# EAGLE board Daughter Card v7 fixed (EAGLE 8.4.1)
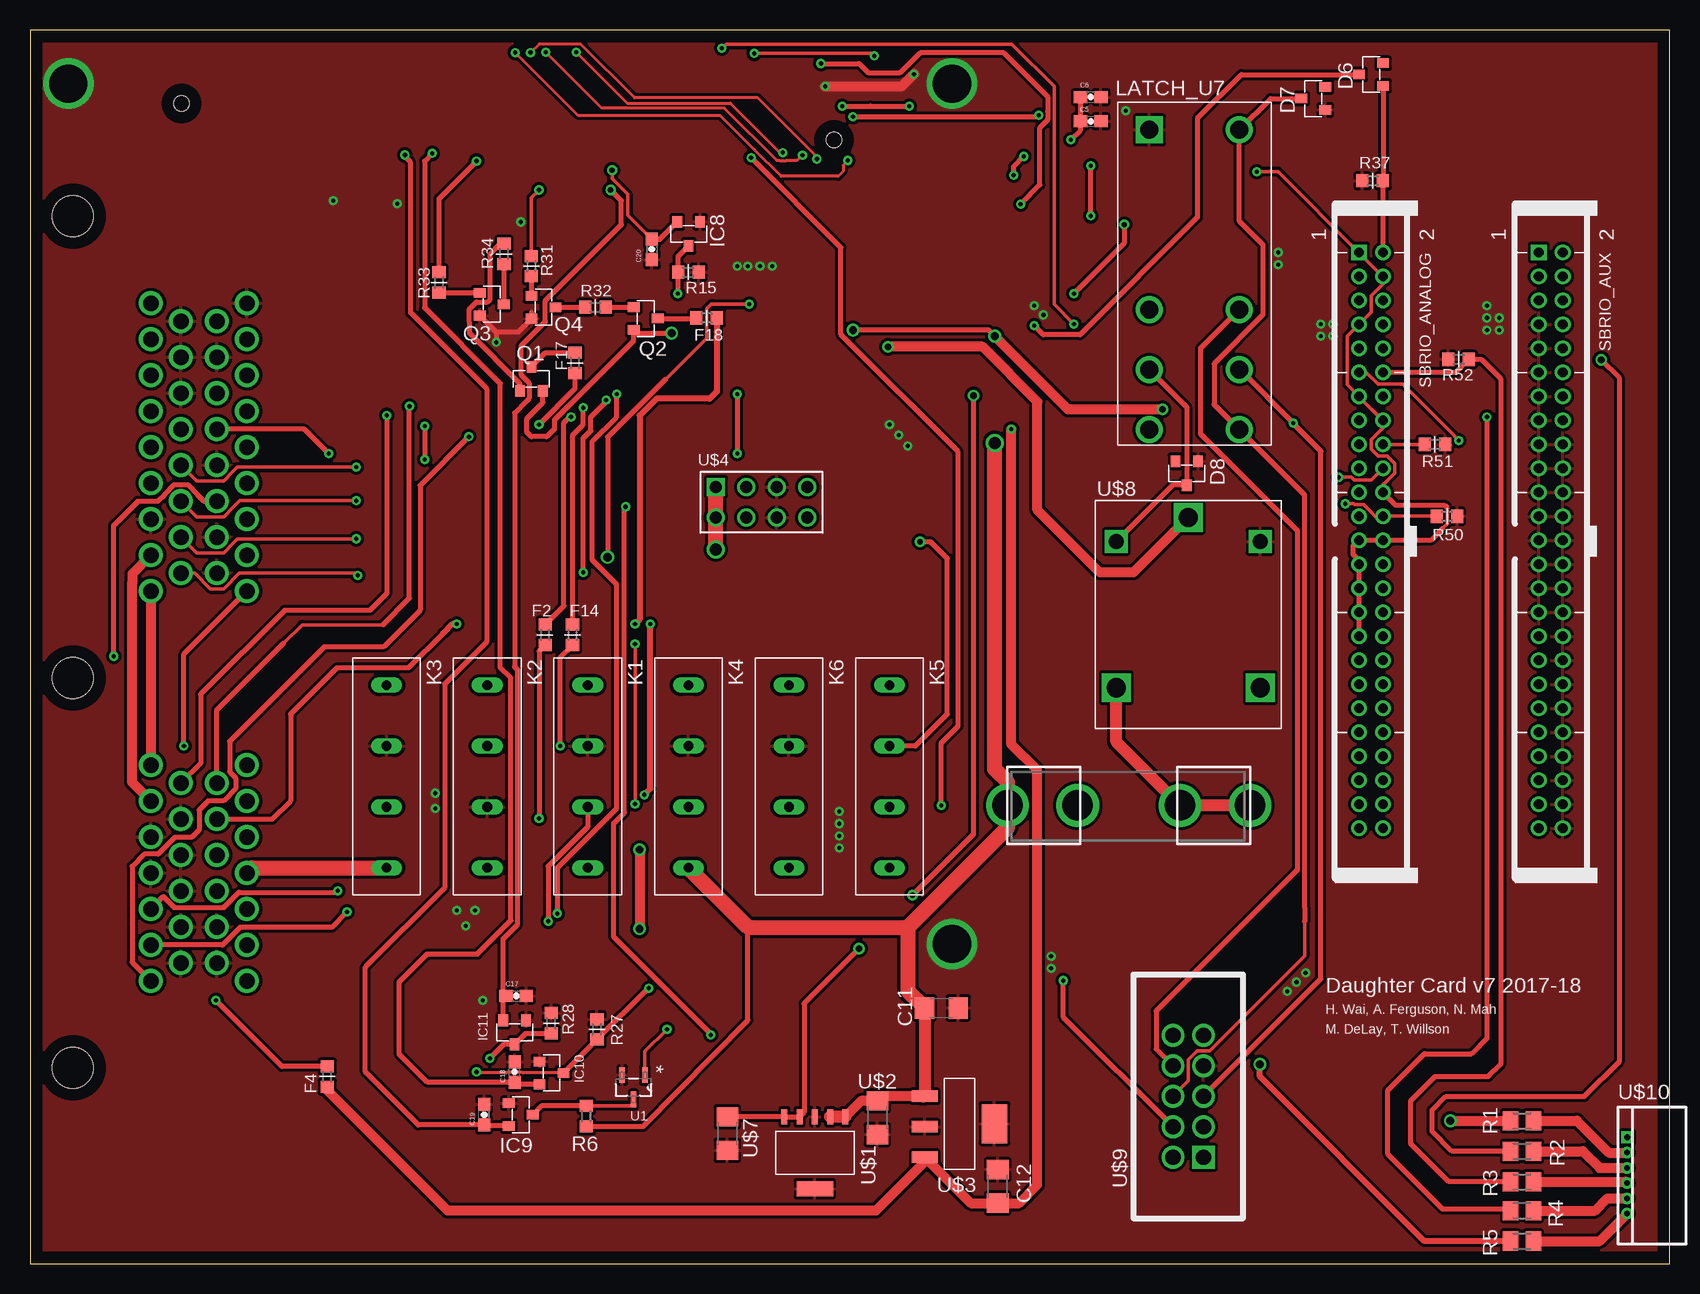
[diagram p2: board, top side]
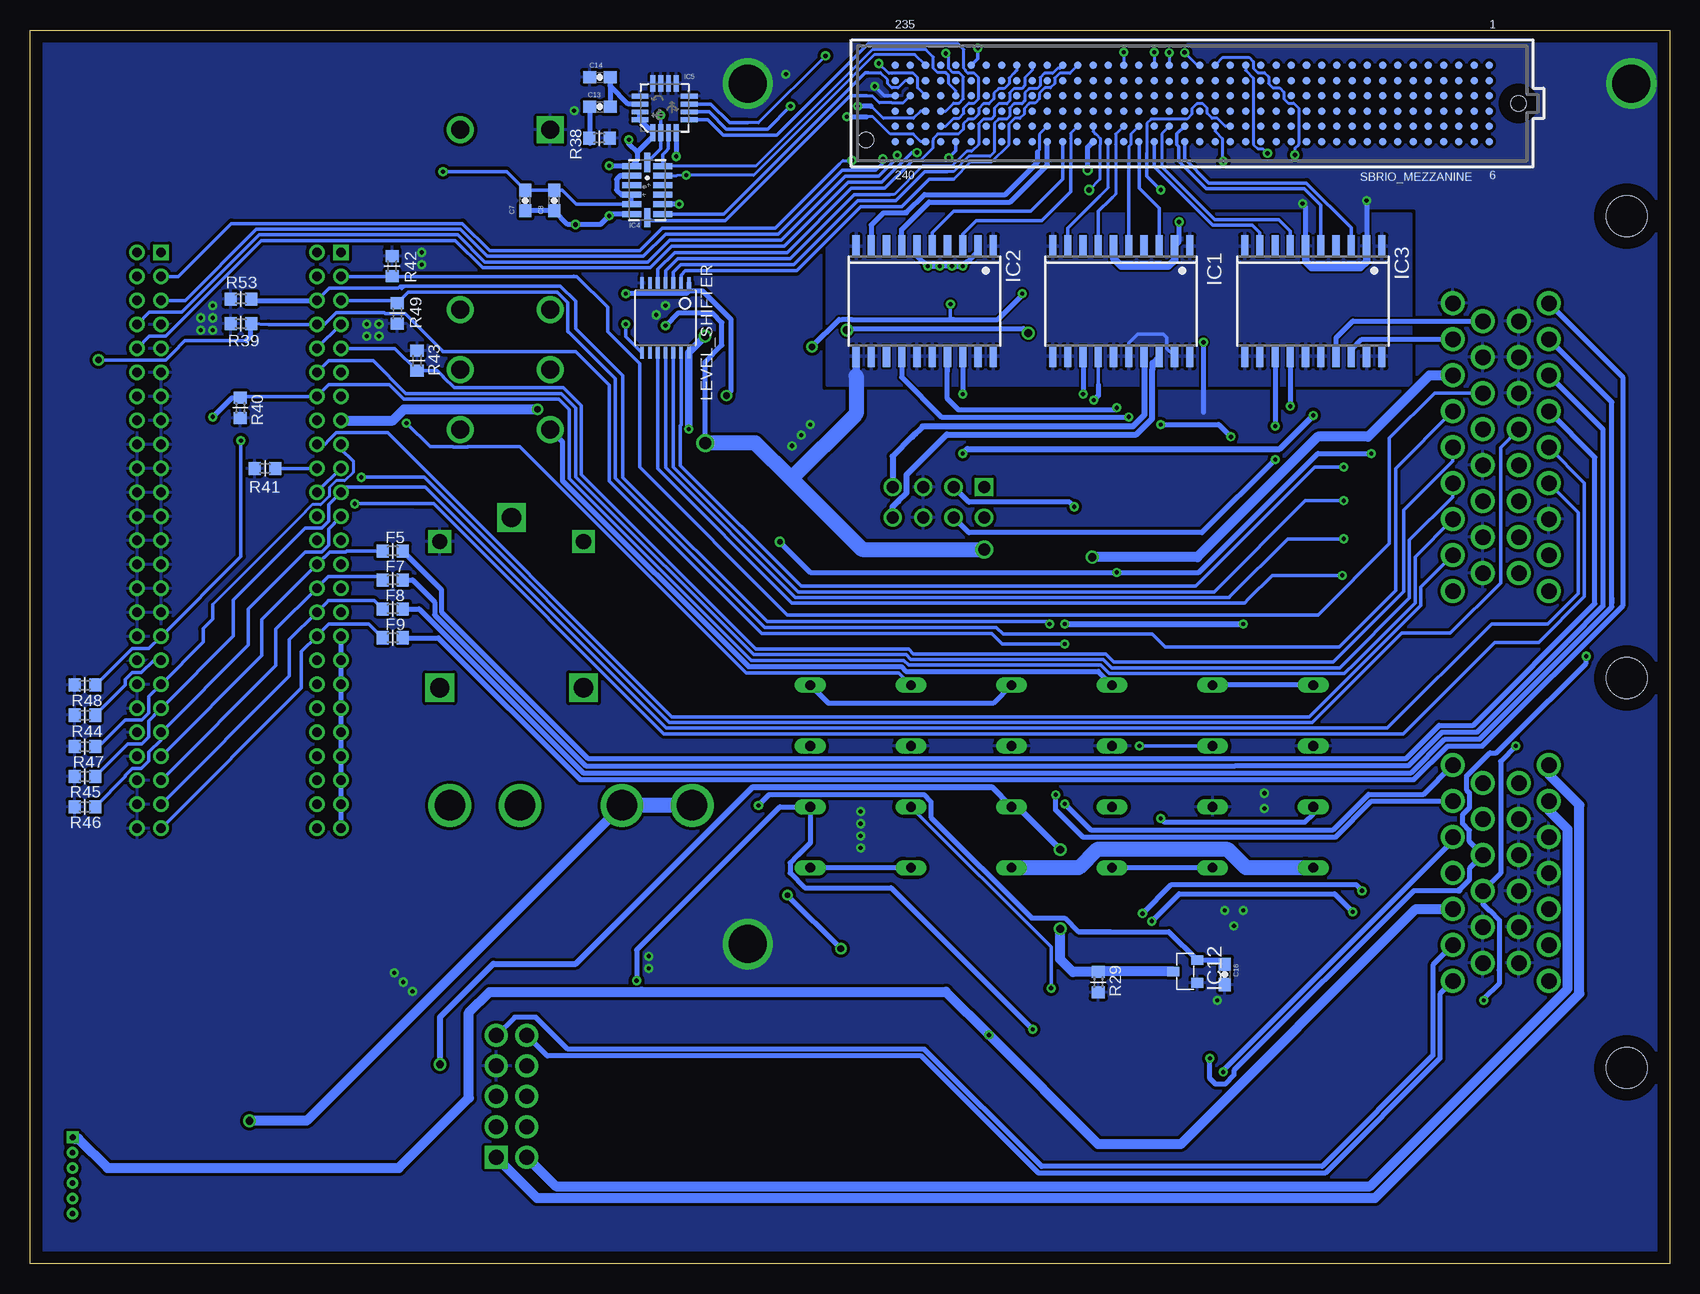
[diagram p3: board, bottom side, seen from below]

Size 136.65 x 102.87 mm. Coordinates in mm from the lower left corner, seen from the top.
Outline: 0,0 136.65,0 136.65,102.87 0,102.87 0,0
Copper layers (1*16): Top 0.035mm / dielectric 1.5mm / Bottom 0.035mm
Design rules "default *": minimum track width 10mil, minimum drill 12mil, track to track 6.5mil, track to pad 6.5mil, pad to pad 6.5mil, via to via 6.5mil, smd to smd 6.5mil, copper to edge 40mil, drill to drill 8mil, minimum pad ring 10mil, minimum via ring 8mil, stop-mask expansion 4mil, vias tented up to drill 0mil, thermal gap 10mil

## Footprints (pad centres in the part's own frame; a part is rotated, then mirrored left to right if it is on the bottom)
0603-CAP = smd 1.1 x 1: 1 -0.85,0; 2 0.85,0
C1206 = smd 1.6 x 1.8: 1 -1.4,0; 2 1.4,0
SOT-23-3 = smd 0.8 x 0.976: P$1 0,1; P$2 -0.95,-1; P$3 0.95,-1
R0603 = smd 1 x 1.1: 1 -0.85,0; 2 0.85,0
FUSE_5MM = drill 2.54 pad 3.556: 1 0,-10.1; 2 0,-4.258; 3 0,4.258; 4 0,10.1
PG-DSO-20 = smd 0.6 x 1.8: 1 -5.715,-4.6; 2 -4.445,-4.6; 3 -3.175,-4.6; 4 -1.905,-4.6; 5 -0.635,-4.6; 6 0.635,-4.6; 7 1.905,-4.6; 8 3.175,-4.6; 9 4.445,-4.6; 10 5.715,-4.6; 11 5.715,4.6; 12 4.445,4.6; 13 3.175,4.6; 14 1.905,4.6; 15 0.635,4.6; 16 -0.635,4.6; 17 -1.905,4.6; 18 -3.175,4.6; 19 -4.445,4.6; 20 -5.715,4.6
LGA14 = smd 0.5 x 1.6: 1 2,1.3; 2 1.2,1.3; 3 0.4,1.3; 4 -0.4,1.3; 5 -1.2,1.3; 6 -2,1.3; 8 -2,-1.3; 9 -1.2,-1.3; 10 -0.4,-1.3; 11 0.4,-1.3; 12 1.2,-1.3; 13 2,-1.3 | smd 1.6 x 0.5: 7 -2.3,0; 14 2.3,0
LGA16-4X4 = smd 1.4 x 0.4: 1 -2.05,0.975; 2 -2.05,0.325; 3 -2.05,-0.325; 4 -2.05,-0.975; 9 2.05,-0.975; 10 2.05,-0.325; 11 2.05,0.325; 12 2.05,0.975 | smd 0.4 x 1.4: 5 -0.975,-2.05; 6 -0.325,-2.05; 7 0.325,-2.05; 8 0.975,-2.05; 13 0.975,2.05; 14 0.325,2.05; 15 -0.325,2.05; 16 -0.975,2.05
HE3621A1250_SPST = drill 0.8 long: C+ -2.54,0; C- 2.54,0; S1 -7.62,0; S2 7.62,0
DPDT_JW2_FORM_C = drill 1.5: CENTER_1 -8,3.75; CENTER_2 -8,-3.75; COIL_2 12,-3.75; NC_1 -3,3.75; NC_2 -3,-3.75; NO_1 -13,3.75; NO_2 -13,-3.75 | drill 1.5 square: COIL_1 12,3.75
TSSOP14 = smd 0.305 x 0.991: 1 -1.95,-2.918; 2 -1.3,-2.918; 3 -0.65,-2.918; 4 0,-2.918; 5 0.65,-2.918; 6 1.3,-2.918; 7 1.95,-2.918; 8 1.95,2.918; 9 1.3,2.918; 10 0.65,2.918; 11 0,2.918; 12 -0.65,2.918; 13 -1.3,2.918; 14 -1.95,2.918
M0805 = smd 1.3 x 1.6: 1 -0.95,0; 2 0.95,0
SBRIO_J502_J503 = drill 0.8 square: P$1 0,0 | drill 0.8: P$2 0,2; P$3 2,0; P$4 2,2; P$5 4,0; P$6 4,2; P$7 6,0; P$8 6,2; P$9 8,0; P$10 8,2; P$11 10,0; P$12 10,2; P$13 12,0; P$14 12,2; P$15 14,0; P$16 14,2; P$17 16,0; P$18 16,2; P$19 18,0; P$20 18,2; P$21 20,0; P$22 20,2; P$23 22,0; P$24 22,2; P$25 24,0; P$26 24,2; P$27 26,0; P$28 26,2; P$29 28,0; P$30 28,2; P$31 30,0; P$32 30,2; P$33 32,0; P$34 32,2; P$35 34,0; P$36 34,2; P$37 36,0; P$38 36,2; P$39 38,0; P$40 38,2; P$41 40,0; P$42 40,2; P$43 42,0; P$44 42,2; P$45 44,0; P$46 44,2; P$47 46,0; P$48 46,2; P$49 48,0; P$50 48,2
SEAM-40-XX.X-XX-06-X-A = smd 0.635 x 0.635: 1 24.765,3.175; 2 24.765,1.905; 3 24.765,0.635; 4 24.765,-0.635; 5 24.765,-1.905; 6 24.765,-3.175; 7 23.495,3.175; 8 23.495,1.905; 9 23.495,0.635; 10 23.495,-0.635; 11 23.495,-1.905; 12 23.495,-3.175; 13 22.225,3.175; 14 22.225,1.905; 15 22.225,0.635; 16 22.225,-0.635; 17 22.225,-1.905; 18 22.225,-3.175; 19 20.955,3.175; 20 20.955,1.905; 21 20.955,0.635; 22 20.955,-0.635; 23 20.955,-1.905; 24 20.955,-3.175; 25 19.685,3.175; 26 19.685,1.905; 27 19.685,0.635; 28 19.685,-0.635; 29 19.685,-1.905; 30 19.685,-3.175; 31 18.415,3.175; 32 18.415,1.905; 33 18.415,0.635; 34 18.415,-0.635; 35 18.415,-1.905; 36 18.415,-3.175; 37 17.145,3.175; 38 17.145,1.905; 39 17.145,0.635; 40 17.145,-0.635; 41 17.145,-1.905; 42 17.145,-3.175; 43 15.875,3.175; 44 15.875,1.905; 45 15.875,0.635; 46 15.875,-0.635; 47 15.875,-1.905; 48 15.875,-3.175; 49 14.605,3.175; 50 14.605,1.905; 51 14.605,0.635; 52 14.605,-0.635; 53 14.605,-1.905; 54 14.605,-3.175; 55 13.335,3.175; 56 13.335,1.905; 57 13.335,0.635; 58 13.335,-0.635; 59 13.335,-1.905; 60 13.335,-3.175; 61 12.065,3.175; 62 12.065,1.905; 63 12.065,0.635; 64 12.065,-0.635; 65 12.065,-1.905; 66 12.065,-3.175; 67 10.795,3.175; 68 10.795,1.905; 69 10.795,0.635; 70 10.795,-0.635; 71 10.795,-1.905; 72 10.795,-3.175; 73 9.525,3.175; 74 9.525,1.905; 75 9.525,0.635; 76 9.525,-0.635; 77 9.525,-1.905; 78 9.525,-3.175; 79 8.255,3.175; 80 8.255,1.905; 81 8.255,0.635; 82 8.255,-0.635; 83 8.255,-1.905; 84 8.255,-3.175; 85 6.985,3.175; 86 6.985,1.905; 87 6.985,0.635; 88 6.985,-0.635; 89 6.985,-1.905; 90 6.985,-3.175; 91 5.715,3.175; 92 5.715,1.905; 93 5.715,0.635; 94 5.715,-0.635; 95 5.715,-1.905; 96 5.715,-3.175; 97 4.445,3.175; 98 4.445,1.905; 99 4.445,0.635; 100 4.445,-0.635; 101 4.445,-1.905; 102 4.445,-3.175; 103 3.175,3.175; 104 3.175,1.905; 105 3.175,0.635; 106 3.175,-0.635; 107 3.175,-1.905; 108 3.175,-3.175; 109 1.905,3.175; 110 1.905,1.905; 111 1.905,0.635; 112 1.905,-0.635; 113 1.905,-1.905; 114 1.905,-3.175; 115 0.635,3.175; 116 0.635,1.905; 117 0.635,0.635; 118 0.635,-0.635; 119 0.635,-1.905; 120 0.635,-3.175; 121 -0.635,3.175; 122 -0.635,1.905; 123 -0.635,0.635; 124 -0.635,-0.635; 125 -0.635,-1.905; 126 -0.635,-3.175; 127 -1.905,3.175; 128 -1.905,1.905; 129 -1.905,0.635; 130 -1.905,-0.635; 131 -1.905,-1.905; 132 -1.905,-3.175; 133 -3.175,3.175; 134 -3.175,1.905; 135 -3.175,0.635; 136 -3.175,-0.635; 137 -3.175,-1.905; 138 -3.175,-3.175; 139 -4.445,3.175; 140 -4.445,1.905; 141 -4.445,0.635; 142 -4.445,-0.635; 143 -4.445,-1.905; 144 -4.445,-3.175; 145 -5.715,3.175; 146 -5.715,1.905; 147 -5.715,0.635; 148 -5.715,-0.635; 149 -5.715,-1.905; 150 -5.715,-3.175; 151 -6.985,3.175; 152 -6.985,1.905; 153 -6.985,0.635; 154 -6.985,-0.635; 155 -6.985,-1.905; 156 -6.985,-3.175; 157 -8.255,3.175; 158 -8.255,1.905; 159 -8.255,0.635; 160 -8.255,-0.635; 161 -8.255,-1.905; 162 -8.255,-3.175; 163 -9.525,3.175; 164 -9.525,1.905; 165 -9.525,0.635; 166 -9.525,-0.635; 167 -9.525,-1.905; 168 -9.525,-3.175; 169 -10.795,3.175; 170 -10.795,1.905; 171 -10.795,0.635; 172 -10.795,-0.635; 173 -10.795,-1.905; 174 -10.795,-3.175; 175 -12.065,3.175; 176 -12.065,1.905; 177 -12.065,0.635; 178 -12.065,-0.635; 179 -12.065,-1.905; 180 -12.065,-3.175; 181 -13.335,3.175; 182 -13.335,1.905; 183 -13.335,0.635; 184 -13.335,-0.635; 185 -13.335,-1.905; 186 -13.335,-3.175; 187 -14.605,3.175; 188 -14.605,1.905; 189 -14.605,0.635; 190 -14.605,-0.635; 191 -14.605,-1.905; 192 -14.605,-3.175; 193 -15.875,3.175; 194 -15.875,1.905; 195 -15.875,0.635; 196 -15.875,-0.635; 197 -15.875,-1.905; 198 -15.875,-3.175; 199 -17.145,3.175; 200 -17.145,1.905; 201 -17.145,0.635; 202 -17.145,-0.635; 203 -17.145,-1.905; 204 -17.145,-3.175; 205 -18.415,3.175; 206 -18.415,1.905; 207 -18.415,0.635; 208 -18.415,-0.635; 209 -18.415,-1.905; 210 -18.415,-3.175; 211 -19.685,3.175; 212 -19.685,1.905; 213 -19.685,0.635; 214 -19.685,-0.635; 215 -19.685,-1.905; 216 -19.685,-3.175; 217 -20.955,3.175; 218 -20.955,1.905; 219 -20.955,0.635; 220 -20.955,-0.635; 221 -20.955,-1.905; 222 -20.955,-3.175; 223 -22.225,3.175; 224 -22.225,1.905; 225 -22.225,0.635; 226 -22.225,-0.635; 227 -22.225,-1.905; 228 -22.225,-3.175; 229 -23.495,3.175; 230 -23.495,1.905; 231 -23.495,0.635; 232 -23.495,-0.635; 233 -23.495,-1.905; 234 -23.495,-3.175; 235 -24.765,3.175; 236 -24.765,1.905; 237 -24.765,0.635; 238 -24.765,-0.635; 239 -24.765,-1.905; 240 -24.765,-3.175 | hole 1.27: 27.191,0; -27.191,-3.048
SOT95P235X112-3N = smd 1.321 x 0.457: 1 -1.016,0.94; 2 -1.016,-0.94; 3 1.016,0
TPS7A4533 = smd 0.508 x 1.27: P$1 -2.54,-2.997; P$2 -1.27,-2.997; P$3 0,-2.997; P$4 1.27,-2.997; P$5 2.54,-2.997 | smd 3.048 x 1.27: P$6 0,2.997
SOT-223-4 = smd 0.95 x 2.15: 1 -2.3,-2.9; 2 0.24,-2.9; 3 2.78,-2.9 | smd 3.25 x 2.15: 4 0,2.9
HARWIN_M20-9980445 = drill 1 square: P1 -3.81,1.27 | drill 1: P2 -1.27,1.27; P3 1.27,1.27; P4 3.81,1.27; P5 -3.81,-1.27; P6 -1.27,-1.27; P7 1.27,-1.27; P8 3.81,-1.27
SUPERSEAL1.0_60POS = drill 1.3 pad 2: A1 7.288,14.526; A2 10.288,14.526; A3 13.288,14.526; A4 16.288,14.526; A5 19.288,14.526; A6 22.288,14.526; A7 25.288,14.526; A8 28.288,14.526; A9 31.288,14.526; A10 8.788,12.026; A11 11.788,12.026; A12 14.788,12.026; A13 17.788,12.026; A14 20.788,12.026; A15 23.788,12.026; A16 26.788,12.026; A17 29.788,12.026; A18 8.788,9.026; A19 11.788,9.026; A20 14.788,9.026; A21 17.788,9.026; A22 20.788,9.026; A23 23.788,9.026; A24 26.788,9.026; A25 29.788,9.026; A26 7.288,6.526; A27 10.288,6.526; A28 13.288,6.526; A29 16.288,6.526; A30 19.288,6.526; A31 22.288,6.526; A32 25.288,6.526; A33 28.288,6.526; A34 31.288,6.526; B1 45.788,14.526; B2 48.788,14.526; B3 51.788,14.526; B4 54.788,14.526; B5 57.788,14.526; B6 60.788,14.526; B7 63.788,14.526; B8 47.288,12.026; B9 50.288,12.026; B10 53.288,12.026; B11 56.288,12.026; B12 59.288,12.026; B13 62.288,12.026; B14 47.288,9.026; B15 50.288,9.026; B16 53.288,9.026; B17 56.288,9.026; B18 59.288,9.026; B19 62.288,9.026; B20 45.788,6.526; B21 48.788,6.526; B22 51.788,6.526; B23 54.788,6.526; B24 57.788,6.526; B25 60.788,6.526; B26 63.788,6.526 | hole 3.4: 0.038,0.026; 38.538,0.026; 71.038,0.026
RELAY = drill 1.6 square: A 14.199,-5.994; B 14.199,5.994; CENTER 0,0 | drill 1.27 square: V1 2.007,5.994; V2 2.007,-5.994
SBRIO_W = drill 1.27 pad 1.778 square: P$1 -5.08,-1.27 | drill 1.27 pad 1.778: P$2 -5.08,1.27; P$3 -2.54,-1.27; P$4 -2.54,1.27; P$5 0,-1.27; P$6 0,1.27; P$7 2.54,-1.27; P$8 2.54,1.27; P$9 5.08,-1.27; P$10 5.08,1.27
SULLINS_1MM_HEADER = drill 0.5 pad 0.61 square: P1 0,0 | drill 0.45 pad 0.61: P2 1.27,0; P3 2.54,0; P4 3.81,0; P5 5.08,0; P6 6.35,0

## Placement (x,y rotation side)
C5  .1uF  [0603-CAP]  88.39,95.25 0 top
C6  10uF  [0603-CAP]  88.39,97.28 0 top
C7  .1uF  [0603-CAP]  95.38,88.65 90 bottom
C8  1uF  [0603-CAP]  92.96,88.65 90 bottom
C11  0.1uF  [C1206]  75.95,21.34 0 top
C12  0.22uF  [C1206]  80.64,6.48 90 top
C13  470nF  [0603-CAP]  89.15,96.47 0 bottom
C14  10nF  [0603-CAP]  89.15,98.93 0 bottom
C16  1uF  [0603-CAP]  37.08,24.13 270 bottom
C17  1uF  [0603-CAP]  40.51,22.35 0 top
C18  1uF  [0603-CAP]  40.39,16 90 top
C19  1uF  [0603-CAP]  37.85,12.45 90 top
C20  1uF  [0603-CAP]  51.82,84.58 270 top
D6  MMBZ5238B-7-F  [SOT-23-3]  111.76,99.16 90 top
D7  DIODE_MMBD4448  [SOT-23-3]  106.93,97.16 90 top
D8  DIODE_MMBD4448  [SOT-23-3]  96.39,65.91 180 top
F2  250mA  [R0603]  42.93,52.45 270 top
F3  FUSEX20MM  [FUSE_5MM]  91.57,38.23 90 top
F4  0.5A PTC  [R0603]  24.77,15.62 90 top
F5  10mA PTC  [R0603]  106.43,59.44 0 bottom
F7  10mA PTC  [R0603]  106.43,57.02 0 bottom
F8  10mA PTC  [R0603]  106.43,54.61 0 bottom
F9  10mA PTC  [R0603]  106.43,52.2 0 bottom
F14  250mA  [R0603]  45.21,52.45 270 top
F17  1A PTC  [R0603]  45.42,75.11 90 top
F18  1A PTC  [R0603]  56.39,78.87 180 top
IC1  BTS716G  [PG-DSO-20]  45.72,80.26 180 bottom
IC2  BTS716G  [PG-DSO-20]  62.1,80.26 180 bottom
IC3  BTS716G  [PG-DSO-20]  29.72,80.26 180 bottom
IC4  ADXL345  [LGA14]  85.22,89.53 90 bottom
IC5  L3G4200D  [LGA16-4X4]  83.77,96.37 90 bottom
IC8  MIC5225-3.3YM5-TR  [SOT-23-3]  54.89,85.88 180 top
IC9  MIC5225-3.3YM5-TR  [SOT-23-3]  40.89,12.45 270 top
IC10  MIC5225-3.3YM5-TR  [SOT-23-3]  43.46,15.93 270 top
IC11  MIC5225-3.3YM5-TR  [SOT-23-3]  40.39,19.3 180 top
IC12  MIC5225-3.3YM5-TR  [SOT-23-3]  40.39,24.38 90 bottom
K1  HE3621A1250_SPST  [HE3621A1250_SPST]  46.48,40.64 90 top
K2  HE3621A1250_SPST  [HE3621A1250_SPST]  38.1,40.64 270 top
K3  HE3621A1250_SPST  [HE3621A1250_SPST]  29.72,40.64 90 top
K4  HE3621A1250_SPST  [HE3621A1250_SPST]  54.86,40.64 90 top
K5  HE3621A1250_SPST  [HE3621A1250_SPST]  71.63,40.64 270 top
K6  HE3621A1250_SPST  [HE3621A1250_SPST]  63.25,40.64 90 top
LATCH_U7  JW2SN-DC12V  [DPDT_JW2_FORM_C]  97.03,82.55 90 top
LEVEL_SHIFTER  [TSSOP14]  83.69,78.87 180 bottom
Q1  MMBT4403-7-F  [SOT-23-3]  41.78,73.79 0 top
Q2  MMBT4403-7-F  [SOT-23-3]  51.31,78.82 270 top
Q3  MMBT4401-7-F  [SOT-23-3]  38.48,80.01 270 top
Q4  MMBT4401-7-F  [SOT-23-3]  42.8,79.76 270 top
R1  0  [M0805]  124.33,11.94 180 top
R2  0  [M0805]  124.33,9.4 180 top
R3  0  [M0805]  124.33,6.86 180 top
R4  0  [M0805]  124.33,4.45 180 top
R5  0  [M0805]  124.33,1.91 180 top
R6  100K  [R0603]  46.35,12.32 90 top
R15  10K  [R0603]  54.86,82.68 0 top
R27  10K  [R0603]  47.24,19.56 90 top
R28  10K  [R0603]  43.43,20.07 90 top
R29  10K  [R0603]  47.62,23.5 270 bottom
R31  4.7K  [R0603]  41.78,83.19 270 top
R32  4.7K  [R0603]  47.12,79.76 0 top
R33  4.7K  [R0603]  34.09,81.81 270 top
R34  4.7K  [R0603]  39.5,84.2 90 top
R37  10K  [R0603]  111.89,90.3 0 top
R38  10K  [R0603]  89.2,93.85 0 bottom
R39  100k  [R0603]  119.08,78.38 180 bottom
R40  100k  [R0603]  119.13,71.37 270 bottom
R41  100k  [R0603]  117.07,66.32 180 bottom
R42  100k  [R0603]  106.48,83.19 90 bottom
R43  100k  [R0603]  104.39,75.31 90 bottom
R44  100k  [R0603]  132.08,45.75 180 bottom
R45  100k  [R0603]  132.08,40.64 180 bottom
R46  100k  [R0603]  132.08,38.1 0 bottom
R47  100k  [R0603]  132.08,43.13 0 bottom
R48  100k  [R0603]  132.08,48.26 0 bottom
R49  100k  [R0603]  106.05,79.25 90 bottom
R50  100k  [R0603]  118.08,62.33 180 top
R51  100k  [R0603]  117.07,68.33 180 top
R52  100k  [R0603]  119.05,75.41 0 top
R53  100k  [R0603]  119.08,80.44 0 bottom
SBRIO_ANALOG  SBRIO_MIO  [SBRIO_J502_J503]  110.74,84.33 270 top
SBRIO_AUX  SBRIO_AUX  [SBRIO_J502_J503]  125.73,84.33 270 top
SBRIO_MEZZANINE  SBRIO_RMC  [SEAM-40-XX.X-XX-06-X-A]  39.8,96.75 0 bottom
U1  DMN3404L-7  [SOT95P235X112-3N]  50.29,14.73 270 top
U$1  TPS7A4533  [TPS7A4533]  65.41,9.27 180 top
U$2  10uF  [C1206]  70.61,12.19 270 top
U$3  LM340MP-5.0  [SOT-223-4]  77.47,11.68 270 top
U$4  HARWIN_M20-9980445  [HARWIN_M20-9980445]  60.96,63.5 0 top
U$6  SUPERSEAL1.0_60POS  [SUPERSEAL1.0_60POS]  3.56,87.38 270 top
U$7  10uF  [C1206]  58.12,10.87 270 top
U$8  RELAY  [RELAY]  96.52,62.23 270 top
U$9  SBRIO_BMS_CONN  [SBRIO_W]  96.52,13.97 90 top
U$10  SULLINS_1MM_6P_HEADER  [SULLINS_1MM_HEADER]  133.1,10.54 270 top

## Tracks (layer width: path | path; a pad name or v marks a point on that pad's centre or on a via)
3.3V  (via drill 0.35, 0.4, 0.45, 0.55)
  Top 0.406: v91.19,86.65 91.19,85.09 v87,80.9 | U$7.1 U$1.P$5 U$1.P$4 64.52,12.65 64.52,21.72 v69.09,26.29 | v78.61,72.39 78.61,35.81 v73.53,30.73 | v88.39,87.38 v88.39,91.57 | v86.74,93.73 87.54,94.53 C5.1 C6.1
  Top 0.813: U$7.1
  Bottom 0.305: LEVEL_SHIFTER.1 | 84.74,93.98 IC5.1 | 86.61,87.44 IC4.6
  Bottom 0.406: 86.96,80.93 v87,80.9 81.95,80.9 81.74,81.11 | C7.1 C8.1 91.82,86.65 v91.19,86.65 89.11,86.65 v88.39,87.38 88.23,87.53 IC4.6 | 84.74,93.98 86.06,92.66 | IC5.1 IC5.16 IC5.15 | 86.06,92.66 86.06,91.99 IC4.1 86.55,91.57 v88.39,91.57 | v73.53,30.73 v69.09,26.29 | 86.06,92.66 86.74,93.34 v86.74,93.73 | v78.61,72.39 78.23,72.77 78.23,78.74 80.6,81.11 81.74,81.11 | LEVEL_SHIFTER.1 81.74,81.11
5V  (via drill 0.35, 0.55, 0.65)
  Top 0.254: 30.22,9.02 30.35,8.89
  Top 0.406: v80.39,77.34 79.88,77.85 v68.58,77.85 | Q1.P$3 42.73,71.82 41.4,70.48 41.4,69.34 41.78,68.96 43.05,68.96 43.69,69.6 43.69,70.36 50.31,76.98 Q2.P$3 50.58,77.6 v53.47,77.6
  Top 0.508: 25.97,13.27 30.35,8.89
  Top 0.813: 74.56,8.89 U$3.3 | v81.76,69.6 81.79,69.57 81.79,43.31 83.93,41.16 83.93,6.59 82.42,5.08 C12.1 78.4,5.08 U$3.3 | F4.1 24.77,14.48 25.97,13.27 34.8,4.45 70.48,4.45 74.57,8.53 U$3.3 | v94.36,71.25 86.49,71.25 v80.39,77.34
  Bottom 0.305: 81.76,75.93 LEVEL_SHIFTER.14
  Bottom 0.406: 81.68,76.01 LEVEL_SHIFTER.14 | v68.58,77.85 68.45,77.98 53.85,77.98 v53.47,77.6
  Bottom 0.61: v81.76,69.6 81.76,75.93 | LEVEL_SHIFTER.14 81.74,75.99 v80.39,77.34
  Bottom 0.813: v80.39,77.34 80.39,77.3 | SBRIO_ANALOG.P$15 106.4,70.33 105.48,71.25 v94.36,71.25
5V_FUSED  (via drill 0.35)
  Top 0.406: v12.83,43.18 12.83,50.83 U$6.A9 | F4.2 20.99,16.47 v15.49,21.97
  Bottom 0.406: v12.83,43.18 14.1,41.91 14.1,32.57 U$6.B11 15.58,30 15.03,29.46 15.02,29.46 14.21,28.66 14.21,24.52 14.23,24.51 14.23,23.37 15.49,22.1 v15.49,21.97
5V_IO_1  (via drill 0.35)
  Top 0.406: F17.1 45.41,72.97 v42.42,69.98 | v36.58,68.96 32.51,64.9 32.51,54.48 29.46,51.44 24.51,51.44 16.64,43.56 16.64,41.02 17.14,40.51 17.14,39.62 16.13,38.61 14.86,38.61 14.1,37.85 14.1,36.2 13.46,35.56 12.06,35.56 10.67,34.16 9.53,34.16 8.51,33.15 8.51,25.16 U$6.B26
  Bottom 0.406: v42.42,69.98 37.59,69.98 v36.58,68.96
12V  (via drill 0.35, 0.65, 1)
  Top 0.406: R6.1 51.09,11.47 59.82,20.32 59.82,28.07 | D6.P$1 100.94,99.16 97.28,95.5 97.28,87.25 87.5,77.47 84.45,77.47 v83.69,78.23
  Top 0.813: v118.36,11.94 R1.2 | U$3.1 71,13.98 U$2.1 69.27,13.59 U$1.P$1
  Top 1.016: C11.1 74.57,21.31 U$3.1 74.31,13.98 | U$1.P$1 U$1.P$2
  Top 1.27: C11.1 73.15,22.73 73.15,28.07 | K3.S1 18.51,33.02 U$6.B4 | 73.15,28.07 81.47,36.38 F3.4 81.47,40.17 80.39,41.24 v80.39,68.45 | K4.S1 59.82,28.07 73.15,28.07 | U$4.P1 U$4.P5 v57.15,59.56
  Bottom 0.305: IC1.19 41.91,76.3 41.91,77.22 42.22,77.52 44.32,77.52 45.09,76.76 IC1.16
  Bottom 0.406: v80.39,68.45 80.39,75.18 78.99,76.58 78.99,78.49 79.76,79.25 82.68,79.25 v83.69,78.23
  Bottom 0.61: 67.82,74.04 IC2.11 67.85,75.69
  Bottom 0.813: F3.3 113.6,11.94 v118.36,11.94
  Bottom 1.27: F3.4 F3.3 | K3.S1 35.31,33.02 36.83,34.54 47.75,34.54 49.28,33.02 K4.S1 | v80.39,68.45 76.2,68.45 73.22,65.47 | 73.22,65.47 67.31,59.56 v57.15,59.56 | 73.22,65.47 67.82,70.87 67.82,74.04
  pour Bottom (isolate 0.152): 21.59,87.5 70.23,87.5 70.23,73.28 21.59,73.28
ACCUMULATOR_FANS
  Bottom 0.508: U$4.P8 64.77,63.13 64.3,63.6 64.28,63.6 63.6,64.28 63.6,65.79 60.25,69.14 44.46,69.14 43.14,70.46 43.14,74.54 43.1,74.59 43.1,75.11 IC1.18
AI7  (via drill 0.35)
  Top 0.305: R50.2 SBRIO_ANALOG.P$24 112.1,62.33 111.72,62.71 111.72,62.73 111.15,63.3 110.4,63.3 110.33,63.37 v109.6,63.37
  Bottom 0.305: U$6.A30 7.11,65.12 7.11,55.63 10.92,51.82 14.61,51.82 22.23,44.2 83.82,44.2 103,63.37 104.52,63.37 | 104.52,63.37 v109.6,63.37 | 104.52,63.37 103.25,63.37
AI8
  Bottom 0.305: 106.61,82.33 SBRIO_ANALOG.P$3 | 106.61,82.33 R42.1 | 91.31,82.33 91.09,82.33 88.52,79.76 88.52,77.72 85.85,75.06 85.85,66.42 73.54,54.11 29.31,54.11 23.37,60.05 23.37,68.83 19.61,72.59 U$6.A12 | 91.31,82.33 91.32,82.33 | 91.31,82.33 106.61,82.33
AI9
  Bottom 0.305: SBRIO_ANALOG.P$5 106.28,80.33 R49.2 105.12,81.03 92.73,81.03 92.7,80.99 92.68,80.99 91.83,80.15 91.83,77.74 91.57,77.47 | 91.57,77.47 91.85,77.75 | 91.57,77.47 87.88,73.79 87.88,65.53 75.42,53.07 56.12,53.07 55.56,52.51 43.12,52.51 42.04,51.44 27.56,51.44 22.86,56.13 22.86,63.58 | 22.86,63.58 | 22.86,63.58 22.86,66.31 U$6.A4
AI10
  Bottom 0.305: SBRIO_ANALOG.P$9 106.26,76.33 R43.1 102.71,74.46 102.22,73.97 102.22,73.95 101.31,73.04 92.2,73.04 90.72,71.56 | 90.72,71.56 | 90.72,71.56 90.72,65.81 76.17,51.26 63.44,51.26 63.05,50.86 47.02,50.86 46.33,50.17 28.06,50.17 22.16,56.07 22.16,62.87 18.08,66.95 U$6.A5
AI11  (via drill 0.35)
  Top 0.305: SBRIO_ANALOG.P$11 111.37,74.33 112.34,73.36 114.39,73.36 118.74,69.01 118.74,68.99 v119.07,68.65
  Bottom 0.305: v119.07,68.65 119.07,58.99 SBRIO_AUX.P$33 126.77,51.29 127.31,51.29 127.33,51.3 128.13,51.3 131.17,48.26 R48.2 131.15,48.26
AI12
  Bottom 0.305: R44.1 128.7,48.27 128.7,48.73 128.13,49.3 127.39,49.3 126.36,50.33 SBRIO_AUX.P$35
AI13
  Bottom 0.254: 121.41,54.99 113.7,62.69 113.7,62.73 113.14,63.29 112.43,63.29 111.7,64.01 111.7,64.72 111.14,65.29 110.43,65.29 109.73,65.99 109.73,66.93
  Bottom 0.305: 130.93,43.13 R47.2 130.93,43.13 | SBRIO_ANALOG.P$17 110.74,67.94 109.73,66.93 | 121.41,54.99 121.41,53.78 122.22,52.96 122.22,51.83 SBRIO_AUX.P$37 126.76,47.3 126.76,45.93 127.33,45.36 128.7,45.36 130.93,43.13
AI15
  Bottom 0.305: SBRIO_ANALOG.P$23 111.3,61.77 111.3,61.73 111.77,61.26 111.77,59.93 112.34,59.36 113.72,59.36 118.45,54.62 118.45,51.6 SBRIO_AUX.P$41 125.73,43.7 126.76,42.67 126.76,41.93 127.39,41.3 128.13,41.3 128.7,40.73 128.7,40.63 R46.2
AMS_OK-  (via drill 0.35)
  Top 0.305: v53.09,19.56 51.23,17.7 U1.1
  Top 0.406: U$9.P$4 86.11,20.57 v86.11,23.62
  Bottom 0.406: v86.11,23.62 86.11,26.16 74.17,38.1 K5.C- 71.63,35.1 72.69,34.04 72.7,34.04 73.3,33.44 73.3,32.6 72.08,31.37 64.9,31.37 v53.09,19.56
AO0
  Bottom 0.305: SBRIO_AUX.P$43 117.35,50.71 117.35,53.72 SBRIO_ANALOG.P$28 112.19,58.89 112.15,58.89 111.68,59.36 110.34,59.36 110.26,59.44 F5.1 107.42,59.29
AO1
  Bottom 0.305: SBRIO_AUX.P$45 116.16,49.9 116.16,52.91 SBRIO_ANALOG.P$30 111.78,57.29 111.16,57.29 111.15,57.3 107.55,57.3 107.54,57.29 | 107.54,57.29 F7.1 107.54,57.29
AO2
  Bottom 0.305: SBRIO_AUX.P$47 115.03,49.03 115.03,52.04 SBRIO_ANALOG.P$32 111.92,55.15 | 111.92,55.15 111.78,55.29 | F8.1 107.95,55.29 110.33,55.29 110.34,55.3 111.77,55.3 111.78,55.29 | 111.78,55.29 111.92,55.15
AO3
  Bottom 0.305: SBRIO_AUX.P$49 114.03,48.03 114.03,51.04 SBRIO_ANALOG.P$34 112.74,52.36 111.76,53.34 108.42,53.34 F9.1
BMS_CAN_H
  Bottom 0.406: U$6.B7 19.17,22.5 19.17,20.32 19.17,17.14 28.73,7.57 42.8,7.57 52.59,7.57 62.37,17.34 93.54,17.34 U$9.P$10
BMS_CAN_L
  Bottom 0.406: U$9.P$9 96.27,20.57 94.49,20.57 91.83,17.91 62.13,17.91 52.36,8.14 28.97,8.14 19.74,17.38 19.74,24.93 U$6.B6
BRAKE_PRESS_IN_1
  Top 0.406: R3.2 118.24,6.86 115.06,10.03 115.06,13.59 117.09,15.62 121.54,15.62 122.56,16.64 122.56,73.79 120.93,75.41 R52.2 118.81,74.33 SBRIO_ANALOG.P$12
  Bottom 0.305: SBRIO_ANALOG.P$12 111.77,75.3 110.34,75.3 110.33,75.29 108.04,75.29 105.32,72.57 92.39,72.57 91.19,71.36 91.19,65.61 76.36,50.79 63.64,50.79 63.24,50.39 47.22,50.39 46.52,49.7 27.52,49.7 21.7,55.52 21.7,60.34 18.08,63.95 U$6.A6
BRAKE_PRESS_IN_2  (via drill 0.35)
  Top 0.406: 123.26,4.57 117.73,4.57 113.16,9.14 113.16,14.48 116.2,17.53 120.14,17.53 121.41,18.8 v121.41,70.61
  Top 0.813: R4.2 123.26,4.57
  Bottom 0.305: R40.1 119.02,72.33 SBRIO_ANALOG.P$14 111.77,73.3 110.34,73.3 110.33,73.29 106.71,73.29 105.52,72.1 92.59,72.1 91.72,71.23 91.72,65.48 76.55,50.32 63.83,50.32 63.44,49.92 47.41,49.92 46.72,49.23 27.11,49.23 26.23,50.11 26.23,50.09 | U$6.A7 21.23,58.94 21.23,55.1 26.23,50.09 | 26.54,49.78 26.23,50.09
  Bottom 0.406: v121.41,70.61 119.8,72.22 R40.1
BRAKELIGHT
  Bottom 0.406: IC3.17 27.81,77.22 26.42,78.61 15.61,78.61 U$6.A10
BSPD_OK+  (via drill 0.65)
  Top 0.508: R5.2 116.2,1.91 102.49,15.62 v102.49,16.64
  Top 0.813: v50.8,34.54 v50.8,27.94
  Bottom 0.508: v102.49,16.64 102.49,20.57 98.04,25.02 91.15,25.02 76.42,39.75 56.52,39.75 K4.C+ 54.36,38.1 v50.8,34.54
  Bottom 0.813: v50.8,27.94 50.8,25.4 49.74,24.34 R29.1 47.59,24.38 IC12.P$1
BUZZER_OUT
  Bottom 0.406: IC3.18 26.54,76.2 25.65,77.09 U$6.A2
CAN_H
  Top 0.813: U$6.A33 8.52,57.53 8.52,56.77 8.5,56.74 8.5,40.17 U$6.B21
  Bottom 0.813: U$9.P$2 92.84,6.48 24.97,6.48 8.51,22.94 8.51,36.24 10.08,37.81 U$6.B21
CAN_L
  Top 0.813: U$6.A34 U$6.B20
  Bottom 0.813: U$9.P$1 94.41,5.51 93.25,5.51 93.24,5.5 24.57,5.5 7.53,22.53 7.53,38.26 10.08,40.81 U$6.B20
COOLANT_PUMP
  Bottom 0.508: U$4.P4 64.77,67.31 63.12,68.96 | 63.12,68.96 62.87,69.22 | IC1.17 43.81,70.74 43.83,70.74 44.76,69.81 62.27,69.81 63.12,68.96
DC_DC_DISABLE  (via drill 0.35)
  Top 0.406: U$6.B9 20.2,37.09 21.72,38.61 21.72,45.85 25.59,49.72 31.56,49.72 34.42,52.58
  Top 0.508: F18.1 57.24,72.73 56.64,72.14 52.22,72.14 50.81,70.73 50.81,53.73 v50.42,53.34 | v35.56,53.34 35.18,53.34 34.42,52.58
  Bottom 0.508: v50.42,53.34 v35.56,53.34
DIO0  (via drill 0.35)
  Top 0.406: v68.58,95.63 83.95,95.63 v84.07,95.76
  Bottom 0.254: 66.93,95.63 66.41,95.63 64.96,94.18 63.04,94.18 62.44,93.57 SBRIO_MEZZANINE.228
  Bottom 0.305: IC4.14 84.09,92.96 IC5.2 84.09,95.74 v84.07,95.76
  Bottom 0.406: v68.58,95.63 66.93,95.63
DIO1  (via drill 0.35)
  Top 0.406: v60.09,92.22 67.57,84.75 67.57,77.48 77.34,67.71 77.34,44.83 75.95,43.43 v75.95,38.23
  Bottom 0.305: SBRIO_MEZZANINE.216 59.49,92.83 v60.09,92.22
  Bottom 0.406: 46.61,27.69 49.3,27.69 | 46.61,27.69 41.74,27.69 IC12.P$3 37.44,25.33 C16.1 | v75.95,38.23 75.05,39.12 62.19,39.12 62.17,39.12 61.57,38.52 61.57,37.23 53.17,28.84 50.43,28.84 | 50.42,28.83 50.43,28.84 | 50.43,28.82 50.43,28.83 50.43,28.84 | 50.43,28.84 49.28,27.69 46.61,27.69
DIO5
  Bottom 0.406: IC2.7 64.01,86.23 61.72,88.52 54.97,88.52 51.87,91.62 SBRIO_MEZZANINE.180
DIO6
  Bottom 0.305: IC2.5 61.47,85.98 59.69,87.76 53.26,87.76 50.6,90.42 SBRIO_MEZZANINE.174
DIO7  (via drill 0.45)
  Top 0.305: C20.1 49.8,87.45 49.8,89.18 48.51,90.46 v48.51,91.19
  Top 0.406: C20.1 52.49,85.43 IC8.P$3
  Bottom 0.406: v48.51,91.19 48.51,93.12 SBRIO_MEZZANINE.162
DIO8
  Bottom 0.254: 47.5,89.03 46.79,89.74 SBRIO_MEZZANINE.156
  Bottom 0.305: 47.5,89.03 50.16,86.36 IC1.9
DIO9
  Bottom 0.254: 44.2,93.52 44.23,93.56 SBRIO_MEZZANINE.144
  Bottom 0.305: IC1.3 42.55,88.01 44.23,89.7 44.23,93.56
DIO10
  Bottom 0.305: IC3.9 34.16,85.98 34.78,86.6 38.1,86.6 42.98,91.47 42.98,91.69 | 42.98,93.38 SBRIO_MEZZANINE.138 42.98,91.69 | 42.98,91.69 42.98,91.49
DIO11
  Bottom 0.305: IC3.3 26.54,86.37 30.29,90.12 38.42,90.12 40.44,92.14 SBRIO_MEZZANINE.126
DIO16
  Bottom 0.254: 67.35,97.39 66.93,97.39 66.48,97.39 65.88,96.79 64.83,96.79 64.82,96.77 63.91,96.77 SBRIO_MEZZANINE.231
  Bottom 0.305: IC4.7 85.12,87.23 84.85,86.97 82.98,86.97 82.97,86.98 78.72,86.98 68.31,97.39 66.93,97.39
DIO17  (via drill 0.35)
  Top 0.406: v82.55,88.34 84.16,89.95 84.16,94.73 84.81,95.38 84.81,95.44 84.82,95.45 84.82,96.07 84.81,96.08 84.81,97.31 81.15,100.97 74.17,100.97 72.52,99.31 69.85,99.31 69.09,100.08 v65.91,100.08
  Bottom 0.254: v65.91,100.08 65.09,99.25 64.83,99.25 64.82,99.26 63.04,99.26 62.69,98.91 62.69,98.04 SBRIO_MEZZANINE.225
  Bottom 0.406: v82.55,88.34 IC4.9
DIO18
  Bottom 0.254: SBRIO_MEZZANINE.213 59.49,97.79 60.1,98.4 60.1,99.08 60.33,99.31 61.01,99.31 61.37,99.67 61.37,100.61 61.99,101.23 65.79,101.23 65.93,101.23 66.46,101.23 76.16,91.53 IC4.13
  Bottom 0.305: IC5.3 83.44,92.96 83.62,92.78 83.62,92.76 83.92,92.47 IC4.13
DIO32
  Bottom 0.254: 66.83,101.7 66.8,101.73 59.31,101.73 58.83,101.24 58.83,99.67 58.67,99.52 58.67,99.44 58.5,99.26 57.96,99.26 57.61,98.91 57.61,97.13 57.96,96.77 58.42,96.77 58.83,96.37 58.83,95.91 59.23,95.5 59.69,95.5 60.35,94.84 SBRIO_MEZZANINE.221
  Bottom 0.305: IC5.5 80.15,95.39 78.87,94.11 74.42,94.11 66.83,101.7
DIO37
  Bottom 0.254: SBRIO_MEZZANINE.179 52.54,94.17 52.54,93.84 52.53,93.83 52.53,92.89 52.7,92.71
  Bottom 0.305: 52.7,91.82 52.7,92
  Bottom 0.406: IC2.9 66.55,86.61 65.55,87.62 63.79,87.62 63.78,87.63 63.63,87.63 62.1,89.15 55.37,89.15 52.7,91.82 | 52.7,92.71 52.7,92
DIO38
  Bottom 0.254: SBRIO_MEZZANINE.167 49.92,94.25 49.92,93.84 49.94,93.83 49.94,92.02 49.91,92
  Bottom 0.305: IC2.3 58.93,85.85 57.78,87 52.32,87 49.91,89.41 49.91,92
DIO39  (via drill 0.45)
  Top 0.406: 39.44,20.39 IC11.P$3 39.44,22.58 | v48.39,89.53 49.28,88.65 49.28,86.64 42.94,80.31 42.94,78.54 42.44,78.04 42.42,78.04 40.95,76.56 40.95,74.08 41.6,73.43 41.6,72.15 41.39,71.93 41.37,71.93 40.39,70.95 40.39,49.78 40.64,49.53 40.64,28.32 39.44,27.12 39.44,22.58 | 39.44,22.58 C17.1
  Bottom 0.254: SBRIO_MEZZANINE.161 48.06,94.42 47.82,94.18 47.8,94.18 47.45,93.83 47.45,93.32 47.5,93.27 47.5,90.42 v48.39,89.53
DIO40
  Bottom 0.254: 46.61,88.77 46.19,89.19 46.19,93.31 46.18,93.32 46.18,94.18 SBRIO_MEZZANINE.149
  Bottom 0.305: IC1.7 47.62,87.76 46.61,88.77 46.48,88.9
DIO41
  Bottom 0.254: 45.09,91.19 45.09,93.14 44.91,93.32 44.91,94.18 SBRIO_MEZZANINE.143
  Bottom 0.305: 45.09,91.95 45.09,91.19 IC1.5
DIO42
  Bottom 0.254: SBRIO_MEZZANINE.131 42.33,94.22 42.33,91.49
  Bottom 0.305: 42.33,91.49 37.91,87.07 33.66,87.07 33.47,87.07 32.59,87.07 31.62,86.11 IC3.7
DIO43
  Bottom 0.305: IC3.5 29.08,88.25 30.48,89.65 38.61,89.65 40.91,91.94 40.91,93.14 41.07,93.31 41.07,94.21 SBRIO_MEZZANINE.125
DIO44  (via drill 0.35)
  Top 0.406: R33.1 34.09,88.82 v37.21,91.95
  Bottom 0.254: SBRIO_MEZZANINE.113 37.9,94.44 37.29,93.83 37.29,92.02 v37.21,91.95
DIO45  (via drill 0.35)
  Top 0.305: v42.42,89.53 41.78,88.9 R31.1
  Bottom 0.254: SBRIO_MEZZANINE.107 37.03,94.84 37.7,95.5 38.15,95.5 38.56,95.91 38.56,96.37 38.91,96.72 39.42,96.72 39.83,96.31 39.83,95.86 40.23,95.45 43.23,95.45 43.59,95.1 43.59,93.32 43.57,93.31 43.57,91.57
  Bottom 0.305: 43.57,92.6 43.57,91.57 43.57,90.69 v42.42,89.53
DIO48
  Bottom 0.254: 67.06,99.31 66.8,99.31 65.79,99.31 65.18,98.7 65.18,98.4 64.82,98.04 64.31,98.04 63.7,98.65 SBRIO_MEZZANINE.230
  Bottom 0.305: 66.8,99.31 67.05,99.31 78.83,87.53 IC4.8
DIO64  (via drill 0.35)
  Top 0.406: v67.69,96.53 70.02,96.53 70.04,96.53 70.05,96.53 v73.27,96.53 v73.28,96.52
  Bottom 0.254: SBRIO_MEZZANINE.226 62.44,96.11 63.04,95.5 65.54,95.5 66.56,96.53
  Bottom 0.305: IC5.6 80.04,96.04 78.61,94.61 75.18,94.61 v73.28,96.52
  Bottom 0.406: v67.69,96.53 66.56,96.53 66.55,96.51
DIO65  (via drill 0.35)
  Top 0.305: v70.36,100.71 70.15,100.92 v60.35,100.92
  Bottom 0.254: v70.36,100.71 75.95,95.12 76.82,95.12 | 60.22,100.92 v60.35,100.92 60.1,100.66 60.1,99.67 59.74,99.31 59.23,99.31 58.88,98.96 58.88,97.13 59.23,96.77 59.69,96.77 60.35,96.11 SBRIO_MEZZANINE.220
  Bottom 0.305: IC5.7 79.93,96.69 78.36,95.12 76.82,95.12
DIO81  (via drill 0.35)
  Top 0.406: v81.97,90.75 81.97,91.49 v82.8,92.33
  Bottom 0.254: SBRIO_MEZZANINE.223 62.92,100.81 66.28,100.81 76.34,90.75 v81.97,90.75 82.75,90.73 IC4.12 | 82.76,94.28 IC5.4
  Bottom 0.305: v82.79,92.34 v82.8,92.33
  Bottom 0.406: IC5.4 v82.79,92.34
DIO83  (via drill 0.35)
  Top 0.305: 81.92,101.6 81.81,101.7 | 81.92,101.6 85.34,98.17 85.34,80.01 v87,78.36 | v57.66,101.35 58.01,101.7 81.81,101.7 | 81.81,101.7 81.92,101.6
  Bottom 0.305: v87,78.36 87,77.3 LEVEL_SHIFTER.8 | v57.66,101.35 57.66,100.48 SBRIO_MEZZANINE.205
DIO85
  Bottom 0.254: SBRIO_MEZZANINE.187 54.41,99.5 54.64,99.26 54.66,99.26 55.07,98.86 55.07,98.4 55.48,97.99 55.93,97.99 56.34,97.58 56.34,97.13 56.74,96.72 57.2,96.72 57.61,96.31 57.61,95.86 58.02,95.45 58.47,95.45 58.88,95.05 58.88,94.59 59.28,94.18 61.01,94.18 61.37,93.83 61.37,93.73 61.42,93.67 61.42,93.03 62.46,91.99 63.08,91.99 63.44,91.63
  Bottom 0.305: LEVEL_SHIFTER.5 84.34,82.92 82.93,84.33 73.53,84.33 68.2,89.66 65.41,89.66 63.44,91.63 63.37,91.69
DIO86
  Bottom 0.254: SBRIO_MEZZANINE.181 53.14,99.52 53.75,98.91 53.75,98.23 53.98,97.99 54.66,97.99 55.02,97.64 55.02,96.96 55.25,96.72 55.93,96.72 56.29,96.37 56.29,95.69 56.52,95.45 57.2,95.45 57.61,95.05 57.61,93.32 58.17,92.75 58.58,92.75 59.83,91.5 62.29,91.5 64.64,89.15 65.41,89.15
  Bottom 0.305: LEVEL_SHIFTER.4 83.69,82.8 82.68,83.82 73.28,83.82 67.94,89.15 65.41,89.15 65.02,89.15
DIO87
  Bottom 0.254: 60.2,91.06 59.69,91.06 58.41,92.33 56.65,92.33 56.29,92.69 56.29,95.1 55.93,95.45 55.25,95.45 55.02,95.69 55.02,96.37 54.66,96.72 53.98,96.72 53.75,96.96 53.75,97.64 53.39,97.99 52.71,97.99 52.48,98.23 52.48,98.91 52.12,99.26 51.44,99.26 51.02,99.68 50.84,99.68 SBRIO_MEZZANINE.169
  Bottom 0.305: 60.2,91.06 62.1,91.06 64.52,88.65 67.69,88.65 73.03,83.31 82.42,83.31 83.04,82.69 LEVEL_SHIFTER.3
DIO88
  Bottom 0.254: 59.69,90.42 58.24,91.87 56.52,91.87 55.07,93.32 55.07,95.05 54.61,95.5 54.15,95.5 53.8,95.86 53.8,96.31 53.4,96.71 | SBRIO_MEZZANINE.163 49.99,99.26 50.85,99.26 51.26,98.86 51.26,98.4 51.61,98.04 52.07,98.04 | 53.34,96.77 53.4,96.71 | 52.07,98.04 | 52.07,98.04 | 53.34,96.77 52.88,96.77 52.53,97.13 52.53,97.58 52.07,98.04 | 53.34,96.77 53.4,96.71
  Bottom 0.305: 59.69,90.42 61.72,90.42 64.01,88.14 67.44,88.14 72.77,82.8 82.04,82.8 82.39,82.45 LEVEL_SHIFTER.2
DIO90  (via drill 0.35)
  Top 0.254: v62.74,92.66 62.48,92.66 58.37,96.77 49.76,96.77 v45.52,101.02
  Bottom 0.254: v45.52,101.02 SBRIO_MEZZANINE.145
  Bottom 0.305: v62.74,92.66 63.17,92.66 65.66,90.17 68.45,90.17 73.79,84.84 83.19,84.84 84.96,83.06 98.93,83.06 101.2,85.32 117.37,85.32 124.76,77.93 125.33,77.36 126.7,77.36 SBRIO_AUX.P$10
DIO91  (via drill 0.35)
  Top 0.254: v42.98,101.02 47.64,96.36 57.86,96.36 62.21,92 62.45,92 62.46,91.99 63.02,91.99 63.03,92 63.93,92 v64.37,92.44
  Bottom 0.254: v42.98,101.02 SBRIO_MEZZANINE.133
  Bottom 0.305: v64.37,92.44 64.37,92.22 65.91,90.68 68.71,90.68 74.04,85.34 83.34,85.34 85.16,83.53 98.74,83.53 101,85.79 117.56,85.79 117.61,85.74 117.64,85.74 124.02,79.37 125.31,79.37 125.33,79.36 126.7,79.36 SBRIO_AUX.P$8
DIO92  (via drill 0.35)
  Top 0.254: v65.58,92.12 65.58,92.29 60.66,97.21 50.38,97.21 45.88,101.7 42.42,101.7 v41.71,100.99
  Bottom 0.254: v41.71,100.99 SBRIO_MEZZANINE.127
  Bottom 0.305: SBRIO_AUX.P$5 123.72,80.33 117.79,86.26 100.81,86.26 98.54,84 85.55,84 83.69,85.85 74.3,85.85 68.96,91.19 66.17,91.19 65.58,91.78 v65.58,92.12
DIO93  (via drill 0.35)
  Top 0.254: v68.15,91.99 67.76,91.6 67.76,91.08 67.35,90.68 62.58,90.68 60.37,92.89 60.35,92.89 57.51,95.73 45.7,95.73 v40.44,100.99
  Bottom 0.254: 69.22,91.69 68.92,91.99 v68.15,91.99 | v40.44,100.99 39.37,99.92 SBRIO_MEZZANINE.115
  Bottom 0.305: SBRIO_AUX.P$3 124.29,82.33 119.88,86.74 100.62,86.74 98.35,84.47 85.84,84.47 83.95,86.36 74.55,86.36 69.22,91.69
DIO94  (via drill 0.35)
  Top 0.305: 31.24,92.33 v31.24,92.46
  Top 0.406: 31.24,92.33 31.73,91.85 31.73,79.29 38.09,72.93 38.09,51.91 34.54,48.37 34.54,31.36 27.94,24.75 27.94,16 32.35,11.6 C19.1 37.95,11.5 IC9.P$3
  Bottom 0.254: SBRIO_MEZZANINE.109 37.24,100.58 35.05,100.58 34.7,100.23 34.7,99.67 34.34,99.31 33.78,99.31 33.43,98.96 33.43,98.4 33.07,98.04 32.51,98.04 32.16,97.69 32.16,97.13 31.8,96.77 31.34,96.77 30.94,96.37 30.94,93.32 31.24,93.02 v31.24,92.46
DIO95  (via drill 0.35)
  Top 0.406: v33.53,92.58 32.89,91.95 32.89,79.7 39.2,73.39 39.2,49.7 40.07,48.83 40.07,28.64 37.27,25.84 33.08,25.84 30.73,23.5 30.73,17.53 33.11,15.15 C18.1 40.56,14.98 IC10.P$3
  Bottom 0.254: v33.53,92.58 33.91,92.96 34.34,92.96 34.7,93.32 34.7,98.86 35.36,99.52 SBRIO_MEZZANINE.97
DIO_GND  (via drill 0.35)
  Top 0.305: SBRIO_ANALOG.P$33 SBRIO_ANALOG.P$31 SBRIO_ANALOG.P$29 SBRIO_ANALOG.P$27 110.74,58.67 | SBRIO_ANALOG.P$16 111.85,71.22 | 110.74,72.03 SBRIO_ANALOG.P$13 | 112.74,81.79 SBRIO_ANALOG.P$4 | SBRIO_ANALOG.P$4 SBRIO_ANALOG.P$1 104.01,91.06 v102.23,91.06 | SBRIO_ANALOG.P$13 SBRIO_ANALOG.P$16 | 112.78,64.99 112.78,65 | 117.73,61.34 117.85,61.46 117.87,61.46 118.08,61.68 118.08,63.05 | 112.78,64.9 112.78,64.99 | 112.78,64.99 113.72,65.93 113.72,66.73 113.09,67.36 112.34,67.36 111.77,67.93 111.77,68.73 112.74,69.7 SBRIO_ANALOG.P$16 | SBRIO_ANALOG.P$13 109.77,73.3 109.77,76.73 109.78,76.74 109.78,77.37 SBRIO_ANALOG.P$7 111.77,79.36 111.77,80.73 112.74,81.7 SBRIO_ANALOG.P$4
  Top 0.406: SBRIO_ANALOG.P$33 110.74,58.67 110.24,59.18 110.24,59.82 SBRIO_ANALOG.P$25 SBRIO_ANALOG.P$26 116.72,60.33 117.73,61.34 | 112.78,64.9 112.78,64.36 SBRIO_ANALOG.P$22 113.82,63.25 117.89,63.25 118.08,63.05
  Bottom 0.305: SBRIO_ANALOG.P$7 111.33,77.74 112.16,76.92 112.16,76.91 SBRIO_ANALOG.P$10 | SBRIO_ANALOG.P$22 112.16,64.91 112.16,64.92 111.25,65.83 SBRIO_ANALOG.P$19 | IC4.4 IC4.5 91.13,88.33 92.29,89.5 C8.2 C7.2 96.94,91.06 v102.23,91.06
  Bottom 0.406: SBRIO_ANALOG.P$33 SBRIO_ANALOG.P$35 SBRIO_ANALOG.P$37 SBRIO_ANALOG.P$39 SBRIO_ANALOG.P$41 SBRIO_ANALOG.P$43 SBRIO_ANALOG.P$45 SBRIO_ANALOG.P$47 SBRIO_ANALOG.P$49 | IC4.2 87.45,90.73 87.76,90.42 87.76,89.53 87.36,89.14 IC4.4
FAN_PWM_OUT  (via drill 0.35)
  Top 0.406: v32.89,69.85 v32.89,67.06
  Bottom 0.406: U$4.P6 58.42,60.96 38.99,60.96 v32.89,67.06 | IC3.13 v32.89,69.85
GND  (via drill 0.35, 3.17)
  Top 0.406: 41.8,79.31 Q4.P$3 40.72,77.72 38.82,77.72 Q3.P$3 38.86,77.68 v38.86,76.83
  Top 0.813: v66.27,98.17 72.64,98.17 v73.66,99.19
  Bottom 0.305: SBRIO_MEZZANINE.237 65.48,97.38 v66.27,98.17
  Bottom 0.406: v40.89,86.87 40.89,85.25 IC1.2 | IC3.6 30.35,88.14 v30.61,88.39 | v25.27,88.65 IC3.2 | v38.86,76.83 38.86,70.99 | IC2.6 62.74,84.07 v61.85,83.19 v60.83,83.19 v59.82,83.19 v58.93,83.19 58.9,83.19 58.49,83.6 58.48,83.6 57.66,84.41 IC2.2
  Bottom 0.61: IC3.2 25.27,83.57 25.78,83.06 29.84,83.06 30.35,83.57 IC3.6 | IC1.2 41.27,83.69 41.78,83.19 45.72,83.19 46.35,83.82 IC1.6
  other vias: 3.2,98.4 76.83,98.4 76.83,26.67 121.41,77.85 121.41,78.87 121.41,79.88 122.43,78.87 122.43,77.85 83.69,79.88 84.45,79.12 67.44,37.72 67.44,36.7 67.44,35.69 67.44,34.67 35.56,29.46 37.08,29.46 36.32,28.19 33.78,39.24 33.78,37.97 71.63,69.98 72.39,69.09 73.15,68.2 85.09,25.65 85.09,24.64 107.57,78.36 108.58,78.36 107.57,77.34 108.58,77.34 104.78,22.73 105.54,23.5 106.3,24.26 37.72,21.97 91.31,96.14 104.01,84.33 104.01,83.31
  pour Bottom (isolate 0.254, rank 6): -1.27,103.76 139.45,103.76 139.45,63.75 139.45,-1.91 120.9,-1.91 -2.03,-1.91 -2.03,5.59 -2.03,103.76
  pour Top (isolate 0.254, rank 6): -0.89,103.76 139.45,103.76 139.45,86.61 139.45,-1.91 108.97,-1.91 -2.03,-1.91 -2.03,5.97 -2.03,103.76
HIGH_CURRENT_IN  (via drill 0.35, 0.55)
  Top 0.305: v50.42,38.35 v50.42,51.69
  Top 0.406: R2.2 118.49,9.4 116.84,11.05 116.84,12.83 117.98,13.97 129.54,13.97 132.46,16.89 132.46,73.84 v130.94,75.37
  Bottom 0.305: R39.1 116.77,78.33 SBRIO_ANALOG.P$8 112.12,78.33 111.15,79.3 107.13,79.3 107.05,79.22 105.36,79.22 105.18,79.03 105.18,79.02 102.23,76.07 | 118.62,76.96 123.74,76.96 124.76,75.94 124.76,75.93 125.33,75.36 128.13,75.36 128.15,75.37 v130.94,75.37 | 102.23,76.07 102.24,76.07 | 102.23,76.07 91.19,76.07 88.39,73.28 88.39,65.28 75.69,52.58 56.52,52.58 55.63,51.69 v50.42,51.69
  Bottom 0.406: 118.62,76.96 118.24,77.34 R39.1 | U$6.B1 20.51,39.16 25.1,39.16 25.43,38.83 | v50.42,38.35 48.26,36.2 28.06,36.2 25.43,38.83 | 25.43,38.83
IMD_OK+  (via drill 0.35)
  Top 0.254: 37.23,15.98 v37.21,16 | IC10.P$1 41.08,15.93 41.01,15.99 39.77,15.99 39.7,15.93 37.29,15.93
  Top 0.406: IC10.P$1 46.74,18.2 R27.1 51.52,22.99 v51.56,22.99 | 37.29,15.93 v37.21,16
  Bottom 0.305: K6.C+ 51.56,26.42 v51.56,22.99
  Bottom 0.406: v37.21,16 37.21,16.13 18.08,35.26 U$6.B3
INTER_OK+  (via drill 0.35)
  Top 0.406: v26.42,29.34 25.15,28.07 17.53,28.07 16.05,26.59 U$6.B25 | K1.C+ 46.48,36.45 43.18,33.15 v43.18,28.57
  Bottom 0.406: v26.42,29.34 27.94,30.86 40.89,30.86 v43.18,28.57
K4
  Bottom 0.406: K4.S2 56.39,46.74 70.1,46.74 K5.S1
LATCH_LED+
  Top 0.406: LATCH_U7.NC_2 97.54,76.31 97.54,69.22 105.61,61.14 105.61,32.84 93.85,21.08 93.85,17.91 U$9.P$8
LATCH_SW_IN
  Top 0.305: 106.22,26.04 106.22,25.7 | 106.22,26.04 106.22,29.72 | U$9.P$6 96.53,15.25 96.53,15.97 96.52,15.98 96.52,17.04 97.26,17.78 98.32,17.78 106.22,25.69 106.22,26.04
  Top 0.406: 106.22,28.52 106.22,29.72 106.22,64.11 LATCH_U7.NO_2 98.68,71.65 98.68,75.06 102.74,79.12 102.74,84.96 100.78,86.93 LATCH_U7.COIL_2 103.38,97.16 D7.P$1
LATCH_SW_OUT  (via drill 0.35)
  Top 0.406: U$9.P$5 107.57,23.75 107.57,67.76 105.28,70.05 v105.28,70.1 100.84,74.55 LATCH_U7.CENTER_2
  Bottom 0.305: K6.S2 64.26,49.28 76.98,49.28 95.83,68.12 100.17,68.12 100.18,68.11 101.38,68.11 101.4,68.14 103.31,68.14 v105.28,70.1
LOW_CURRENT_IN  (via drill 0.35)
  Top 0.508: v51.18,39.12 51.69,39.62 v51.69,53.34
  Bottom 0.305: R53.2 118.21,80.33 | 51.88,53.53 v51.69,53.34 51.89,53.54 75.23,53.54 87.25,65.56 87.25,74.04 91.19,77.98 91.19,80.26 92.46,81.53 105.41,81.53 | 105.41,81.53 105.66,81.29 | 105.41,81.53 105.78,81.53 105.96,81.36 111.72,81.36 SBRIO_ANALOG.P$6
  Bottom 0.406: U$6.B2 24.86,38.59 27.89,35.56 48.9,35.56 51.18,37.85 v51.18,39.12 | SBRIO_ANALOG.P$6 118.11,80.33 R53.2
N$2
  Bottom 0.406: K3.S2 K2.S1
N$3
  Bottom 0.406: U$6.A29 6.24,67.24 6.24,55.04 16.38,44.9 19.22,44.9 21.96,42.16 90.16,42.16 102.36,54.36 102.36,56.22 F5.2
N$4
  Top 0.305: R37.2
  Top 0.406: D6.P$2 112.76,90.32 R37.2 SBRIO_ANALOG.P$2
N$5
  Top 0.406: R34.2 39.2,85.05 38.34,84.18 38.34,80.41 38.12,80.19 37.2,80.19 36.62,79.61 36.62,78.51 36.64,78.5 36.64,77.58 40.83,73.39 Q1.P$2
N$6
  Bottom 0.406: U$6.A28 5.59,69.59 5.59,54.83 8.55,51.86 16.09,44.32 18.99,44.32 21.79,41.52 36.2,41.52 90.33,41.52 102.93,54.12 102.93,55.18 104.78,57.02 F7.2
N$7
  Bottom 0.406: K2.S2 K1.S1
N$8
  Top 0.406: R34.1 39.5,80.03 Q3.P$1
N$9
  Bottom 0.406: 4.83,55.5 4.83,55.12 | 4.83,55.5 4.83,71.83 U$6.A27 | 105.4,54.61 F8.2 104.23,54.61 90.57,40.95 21.56,40.95 18.75,43.75 15.86,43.75 4.83,54.78 4.83,55.5
N$10
  Bottom 0.406: U$6.A26 3.94,73.94 3.94,54.86 15.62,43.18 18.51,43.18 21.32,40.37 90.8,40.37 102.63,52.2 F9.2
N$11
  Bottom 0.406: C13.1 90,93.4 R38.1
N$12
  Top 0.813: R1.1 128.91,11.94 131.57,9.27 U$10.P2
N$13
  Bottom 0.406: K6.S1 K5.S2
N$14
  Top 1.016: F3.1 F3.2 90.53,43.53 U$8.A
N$15
  Top 0.813: R2.1 129.41,9.4 130.81,8 U$10.P3
N$16
  Top 0.813: R3.1 132.97,6.86 U$10.P4
N$17
  Top 0.813: R4.1 130.43,4.45 131.44,5.46 U$10.P5
N$18
  Top 0.406: Q4.P$1 R32.1
N$19
  Top 0.406: R31.2 41.78,80.72 Q4.P$2
N$20
  Top 0.813: R5.1 130.81,1.91 U$10.P6
N$22
  Top 0.406: R33.2 Q3.P$2
N$24
  Top 0.305: U1.3 50.25,13.17 R6.2
  Top 0.406: R6.2 42.62,13.17 IC9.P$1
N$37
  Bottom 0.406: 88.3,98.81 C14.2 | 88.3,98.81 C13.2 | IC5.14 86.79,96.69 88.3,98.21 88.3,98.81
N$56
  Top 0.406: Q1.P$1 42.95,75.96 F17.2
N$57
  Top 0.406: Q2.P$1 55.49,78.82 F18.2
N$58
  Top 0.406: R32.2 50.3,79.76 Q2.P$2
PO3  (via drill 0.35, 0.45)
  Top 0.406: K5.C+ 73.79,43.18 76.45,45.85 76.45,58.8 75.06,60.2 v74.17,60.2 | v46.1,57.66 46.1,68.83 46.74,69.47 46.74,70.61 47.69,71.56 | 47.69,71.56 47.88,71.75 | v24.89,67.56 22.87,69.59 U$6.A13 | 47.69,71.56 48.01,71.88 v48.01,72.01
  Bottom 0.305: IC1.14 47.62,73.28
  Bottom 0.406: v74.17,60.2 71.63,57.66 v46.1,57.66 39.24,57.66 29.34,67.56 v24.89,67.56 | v48.01,72.01 47.62,72.39 47.62,73.28
POSITIVE_AIR_ENABLE  (via drill 0.35)
  Top 0.305: 20.19,50.8 21.14,51.75 22.67,53.28 29.4,53.28
  Top 0.406: U$6.B8 15.58,46.19 21.14,51.75 | 29.4,53.28 31.62,55.5 v31.62,71.5
  Bottom 0.406: IC3.14 v31.62,71.5
PRECHARGE_DONE+  (via drill 0.35)
  Top 0.406: v43.94,29.21 43.94,33.02 48.9,37.97 48.9,56.64 46.86,58.67 46.86,68.58 48.9,70.61 v48.9,72.52 | 10.21,29.72 U$6.B24 11.11,30.62 12.02,29.72 16.15,29.72 17.42,30.99 25.53,30.99 v25.65,31.11
  Bottom 0.406: v25.65,31.11 26.16,31.62 41.53,31.62 v43.94,29.21 | IC1.13 v48.9,72.52
SBRIO_OK+_1  (via drill 0.35)
  Top 0.406: F2.1 44.49,54.86 44.49,70.14 44.96,70.61 v45.09,70.61
  Bottom 0.406: IC2.14 64.01,73.91 60.71,70.61 v45.09,70.61
SBRIO_OK+_1_RELAY_IN  (via drill 0.35)
  Top 0.406: F2.2 42.42,51.09 v42.42,37.13
  Bottom 0.406: K3.C+ 29.72,37.52 30.4,36.83 42.12,36.83 v42.42,37.13
SBRIO_OK+_2  (via drill 0.35)
  Top 0.406: F14.1 45.21,69.09 46.1,69.98 v46.1,71.37
  Bottom 0.406: 60.2,74.68 IC2.17 | 60.2,74.68 60.2,74.42 | v46.1,71.37 46.28,71.2 59.26,71.2 60.2,72.14 60.2,74.68
SBRIO_OK_2_RELAY  (via drill 0.35)
  Top 0.406: v44.2,43.18 44.2,50.59 F14.2
  Bottom 0.305: K2.C+ v44.2,43.18
SHUTDOWN_OK+
  Bottom 0.406: LATCH_U7.NO_1 92.28,68.55 92.28,65.31 76.77,49.8 64.05,49.8 63.65,49.4 47.62,49.4 K1.S2
SIGNAL_GND  (via drill 0.35)
  Top 0.406: v56.73,19.09 56.73,19.19 48.62,27.3 48.62,36.7 49.53,37.62 49.53,63.02 v49.63,63.12
  Bottom 0.406: U$4.P2 58.42,63.5 50.01,63.5 v49.63,63.12
  Bottom 0.813: U$10.P1 132.99,10.43 132.61,10.43 130.18,8 105.92,8 100.08,13.84 100.08,20.95 98.36,22.67 85.71,22.67 85.7,22.68 60.33,22.68 v56.73,19.09 47.63,9.98 40.76,9.98 21.16,29.59 U$6.B5
STEERING_POS
  Bottom 0.305: U$6.A31 7.62,62.63 7.62,55.88 10.16,53.34 14.86,53.34 23.53,44.67 83.62,44.67 103.73,64.77 110.3,64.77 SBRIO_ANALOG.P$21 111.77,63.3 111.77,61.93 112.34,61.36 113.72,61.36 119.71,55.36 119.71,52.35 SBRIO_AUX.P$39 126.29,45.77 126.29,45.73 126.76,45.26 126.76,43.93 127.33,43.36 128.51,43.36 R45.1
THROTTLE_IN_1
  Top 0.305: R51.2 SBRIO_ANALOG.P$18
  Bottom 0.305: SBRIO_ANALOG.P$18 112.1,68.33 111.72,68.71 111.72,68.73 111.15,69.3 110.34,69.3 110.33,69.29 106.85,69.29 83.17,45.61 30.06,45.61 20.75,54.91 20.75,55.35 20.73,55.37 | U$6.A8 20.73,56.43 20.73,55.37 | 20.73,55.37 20.73,54.95
THROTTLE_IN_2  (via drill 0.35)
  Top 0.305: SBRIO_ANALOG.P$20 111.76,65.34 110.34,65.34 110.1,65.58 v109.04,65.58
  Bottom 0.305: R41.1 SBRIO_ANALOG.P$20 | U$6.A21 14.1,68.07 14.1,56.77 18.28,52.59 22.34,52.59 29.79,45.14 83.36,45.14 103.81,65.58 v109.04,65.58
THROTTLE_OK_OUT  (via drill 0.35)
  Top 0.406: v58.93,72.52 v58.93,67.56 | v29.72,70.74 29.72,55.88 28.32,54.48 21.21,54.48 14.22,47.5 14.22,41.73 U$6.B14
  Bottom 0.406: IC2.18 v58.93,72.52
  Bottom 0.508: v29.72,70.74 32.51,67.94 58.55,67.94 v58.93,67.56
TSMS_IN+  (via drill 0.35)
  Top 0.406: U$6.A15 14.5,63.59 13.95,64.14 13.95,64.16 13.15,64.96 12.02,64.96 11.21,64.16 11.21,64.14 10.66,63.59 8.98,63.59 8.98,63.56 7.19,61.77 | 7.19,61.77 7.18,61.78 | v6.97,50.66 6.97,61.56 7.19,61.77 | IC11.P$1 41.3,19.22 R28.1 | IC11.P$1 40.36,18.28 | IC11.P$1 39.48,18.3 v38.33,17.14
  Bottom 0.406: v6.97,50.66 6.97,50.07 13.12,43.93 13.14,43.93 14.44,42.62 14.99,42.62 16.95,40.66 16.95,39.52 16.71,39.28 16.71,38.02 17.27,37.46 17.27,36.71 16.71,36.16 16.71,35.22 U$6.B10 16.71,32.96 16.71,32.02 17.52,31.22 17.55,31.22 17.65,31.11 | 17.65,31.11 17.47,31.11 | 17.65,31.11 21.34,31.11 36.32,16.13 36.32,15.75 37.08,14.99 37.85,14.99 38.33,15.47 v38.33,17.14
TSMS_OUT+  (via drill 0.35, 0.55, 0.7)
  Top 0.305: 52.96,73.76 56.4,77.2 56.39,77.22 56.39,79.63 56.77,80.01 56.9,80.01 v59.94,80.01
  Top 0.406: IC8.P$1 54.01,84 R15.1 54.01,80.94 v53.98,80.9 | v48.13,58.93 48.13,68.93 52.96,73.76
  Top 0.813: U$8.CENTER 91.95,57.66 89.15,57.66 83.95,62.87 83.95,71.88 79.38,76.45 v71.5,76.45
  Bottom 0.305: v59.94,80.01 59.94,78.74
  Bottom 0.406: v53.98,80.9 53.98,80.77 56.01,78.74 59.69,78.74 | v71.5,76.45 69.22,78.74 68.96,78.74 68.95,78.75 68.21,78.75 68.2,78.74 59.69,78.74 | 59.69,78.74 59.94,78.74
  Bottom 0.813: U$6.A3 20.02,74.09 25.15,68.96 29.34,68.96 39.37,58.93 v48.13,58.93
TSMS_OUT_CTRL+
  Top 0.406: LATCH_U7.CENTER_1 96.39,71.44 D8.P$1 95.22,64.91 U$8.V2
WS1  (via drill 0.35)
  Top 0.305: U$6.A22 13.89,65.28 15.02,65.28 15.04,65.27 16.13,65.27 16.9,66.04 16.9,66.06 17.26,66.42 v27.18,66.42 27.15,66.39
  Bottom 0.305: v27.18,66.42 29.59,66.42 39.5,56.52 72.39,56.52 82.45,66.57 82.45,69.3 82.46,69.31 82.46,69.88 82.39,69.95 LEVEL_SHIFTER.13
WS2  (via drill 0.35)
  Top 0.305: v27.18,63.63 17.47,63.63 16.9,63.06 16.9,63.04 16.13,62.27 15.04,62.27 15.02,62.28 13.89,62.28 U$6.A23
  Bottom 0.305: LEVEL_SHIFTER.12 83.04,66.43 72.64,56.03 37.97,56.03 30.38,63.63 v27.18,63.63
WS3  (via drill 0.35)
  Top 0.305: v27.18,60.45 17.29,60.45 16.9,60.06 16.9,60.04 16.13,59.27 15.04,59.27 15.02,59.28 13.89,59.28 U$6.A24
  Bottom 0.305: LEVEL_SHIFTER.11 83.69,66.37 72.9,55.58 72.85,55.58 72.84,55.56 36.72,55.56 36.61,55.66 | v27.18,60.45 31.83,60.45 36.61,55.66 | 36.61,55.66 36.7,55.58
WS4  (via drill 0.35)
  Top 0.305: v27.3,57.4 27.19,57.39 | v27.3,57.4 | v27.3,57.4 27.12,57.59 17.45,57.59 16.13,56.27 15.04,56.27 13.72,57.59 U$6.A25
  Bottom 0.305: LEVEL_SHIFTER.10 84.34,66.31 73.15,55.12 73.11,55.12 73.08,55.09 35.46,55.09 35.43,55.12 | v27.3,57.4 33.15,57.4 35.12,55.44 | 35.12,55.44 35.43,55.12 | 35.43,55.12 35.12,55.44

## Text on the board
tNames: Daughter Card v7 2017-18 | H. Wai, A. Ferguson, N. Mah | M. DeLay, T. Willson